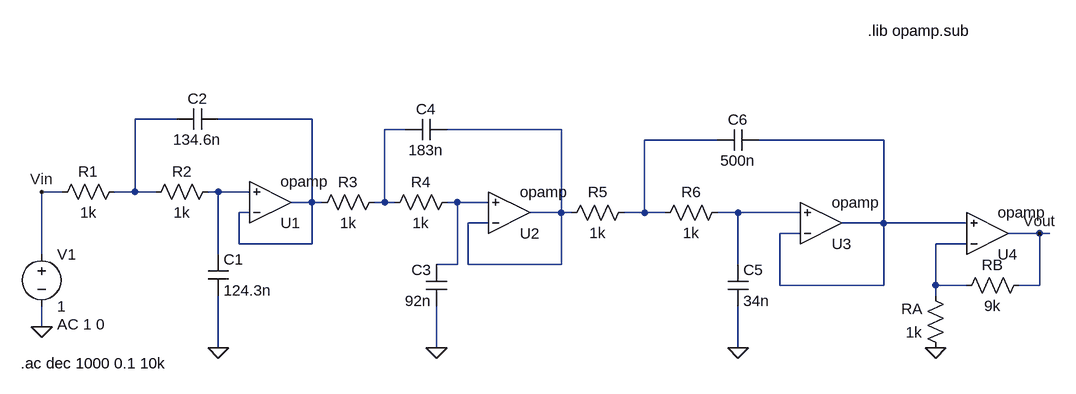
[diagram p0: schematic Ex3_1.asc]
Ex3_1.asc, the LTspice schematic file:
Version 4
SHEET 1 1516 680
WIRE 144 -96 80 -96
WIRE 352 -96 208 -96
WIRE 496 -80 464 -80
WIRE 736 -80 560 -80
WIRE 976 -64 864 -64
WIRE 1232 -64 1040 -64
WIRE -32 16 -64 16
WIRE 80 16 80 -96
WIRE 80 16 48 16
WIRE 112 16 80 16
WIRE 208 16 192 16
WIRE 256 16 208 16
WIRE 352 32 352 -96
WIRE 352 32 320 32
WIRE 368 32 352 32
WIRE 464 32 464 -80
WIRE 464 32 448 32
WIRE 480 32 464 32
WIRE 576 32 560 32
WIRE 624 32 576 32
WIRE 256 48 240 48
WIRE 736 48 736 -80
WIRE 736 48 688 48
WIRE 752 48 736 48
WIRE 864 48 864 -64
WIRE 864 48 832 48
WIRE 896 48 864 48
WIRE 1008 48 976 48
WIRE 1104 48 1008 48
WIRE 624 64 592 64
WIRE 1232 64 1232 -64
WIRE 1232 64 1168 64
WIRE 1360 64 1232 64
WIRE 1104 80 1072 80
WIRE 1472 80 1424 80
WIRE 1488 80 1472 80
WIRE 240 96 240 48
WIRE 352 96 352 32
WIRE 352 96 240 96
WIRE 1360 96 1312 96
WIRE -64 112 -64 16
WIRE 208 112 208 16
WIRE 576 128 576 32
WIRE 576 128 544 128
WIRE 592 128 592 64
WIRE 736 128 736 48
WIRE 736 128 592 128
WIRE 1008 128 1008 48
WIRE 1072 160 1072 80
WIRE 1232 160 1232 64
WIRE 1232 160 1072 160
WIRE 1312 160 1312 96
WIRE 1360 160 1312 160
WIRE 1472 160 1472 80
WIRE 1472 160 1440 160
WIRE 1312 176 1312 160
WIRE -64 224 -64 192
WIRE 208 256 208 176
WIRE 544 256 544 192
WIRE 1008 256 1008 192
FLAG -64 224 0
FLAG 1312 256 0
FLAG 208 256 0
FLAG 544 256 0
FLAG 1008 256 0
FLAG -64 16 Vin
FLAG 1472 80 Vout
SYMBOL voltage -64 96 R0
WINDOW 123 24 124 Left 2
WINDOW 39 0 0 Left 0
SYMATTR Value2 AC 1 0
SYMATTR InstName V1
SYMATTR Value 1
SYMBOL OpAmps\\opamp 656 112 M180
SYMATTR InstName U2
SYMBOL OpAmps\\opamp 1136 128 M180
SYMATTR InstName U3
SYMBOL OpAmps\\opamp 288 96 M180
SYMATTR InstName U1
SYMBOL OpAmps\\opamp 1392 144 M180
SYMATTR InstName U4
SYMBOL res 64 0 R90
WINDOW 0 0 56 VBottom 2
WINDOW 3 32 56 VTop 2
SYMATTR InstName R1
SYMATTR Value 1k
SYMBOL res 208 0 R90
WINDOW 0 0 56 VBottom 2
WINDOW 3 32 56 VTop 2
SYMATTR InstName R2
SYMATTR Value 1k
SYMBOL cap 192 112 R0
SYMATTR InstName C1
SYMATTR Value 124.3n
SYMBOL cap 208 -112 R90
WINDOW 0 0 32 VBottom 2
WINDOW 3 32 32 VTop 2
SYMATTR InstName C2
SYMATTR Value 134.6n
SYMBOL cap 560 192 R180
WINDOW 0 24 56 Left 2
WINDOW 3 24 8 Left 2
SYMATTR InstName C3
SYMATTR Value 92n
SYMBOL cap 560 -96 R90
WINDOW 0 0 32 VBottom 2
WINDOW 3 32 32 VTop 2
SYMATTR InstName C4
SYMATTR Value 183n
SYMBOL cap 992 128 R0
SYMATTR InstName C5
SYMATTR Value 34n
SYMBOL cap 1040 -80 R90
WINDOW 0 0 32 VBottom 2
WINDOW 3 32 32 VTop 2
SYMATTR InstName C6
SYMATTR Value 500n
SYMBOL res 464 16 R90
WINDOW 0 0 56 VBottom 2
WINDOW 3 32 56 VTop 2
SYMATTR InstName R3
SYMATTR Value 1k
SYMBOL res 576 16 R90
WINDOW 0 0 56 VBottom 2
WINDOW 3 32 56 VTop 2
SYMATTR InstName R4
SYMATTR Value 1k
SYMBOL res 848 32 R90
WINDOW 0 0 56 VBottom 2
WINDOW 3 32 56 VTop 2
SYMATTR InstName R5
SYMATTR Value 1k
SYMBOL res 992 32 R90
WINDOW 0 0 56 VBottom 2
WINDOW 3 32 56 VTop 2
SYMATTR InstName R6
SYMATTR Value 1k
SYMBOL res 1328 272 R180
WINDOW 0 36 76 Left 2
WINDOW 3 36 40 Left 2
SYMATTR InstName RA
SYMATTR Value 1k
SYMBOL res 1344 176 R270
WINDOW 0 32 56 VTop 2
WINDOW 3 0 56 VBottom 2
SYMATTR InstName RB
SYMATTR Value 9k
TEXT 1208 -232 Left 2 !.lib opamp.sub
TEXT -96 280 Left 2 !.ac dec 1000 0.1 10k

The netlist it stands for:
* Ex3_1.asc
V1 Vin 0 1 AC 1 0
XU2 N004 N008 N004 opamp Aol=100K GBW=10Meg  ; pins invin noninvin out
XU3 N006 N009 N006 opamp Aol=100K GBW=10Meg  ; pins invin noninvin out
XU1 N002 N007 N002 opamp Aol=100K GBW=10Meg  ; pins invin noninvin out
XU4 N010 N006 Vout opamp Aol=100K GBW=10Meg  ; pins invin noninvin out
R1 N001 Vin 1k
R2 N007 N001 1k
C1 N007 0 124.3n
C2 N002 N001 134.6n
C3 0 N008 92n
C4 N004 N003 183n
C5 N009 0 34n
C6 N006 N005 500n
R3 N003 N002 1k
R4 N008 N003 1k
R5 N005 N004 1k
R6 N009 N005 1k
RA 0 N010 1k
RB N010 Vout 9k
.lib opamp.sub
.ac dec 1000 0.1 10k
.backanno
.end